# Altium schematic sheet CAN 3V3.SchDoc
size A
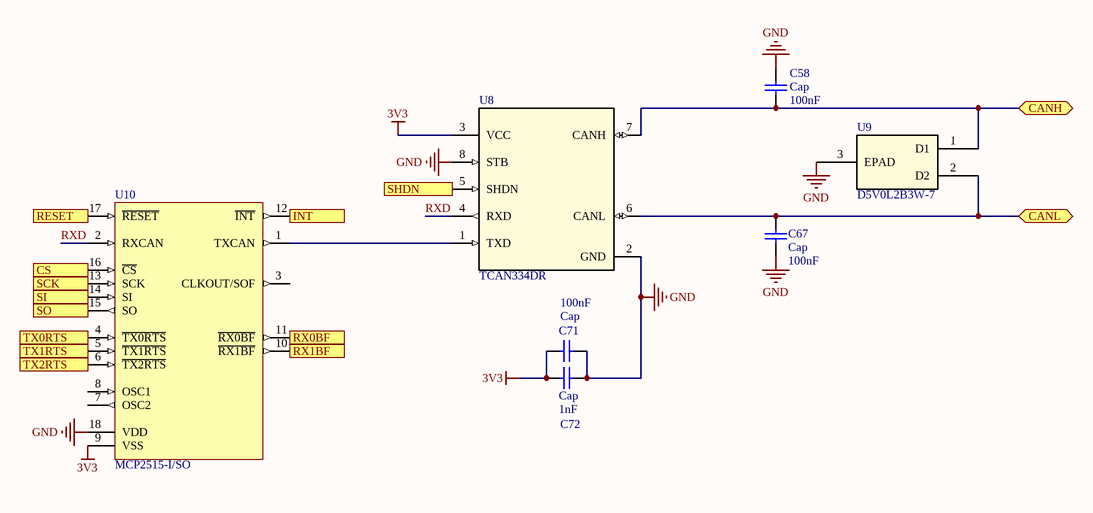
[diagram p0: CAN 3V3.SchDoc]

## Parts
C58  Cap  value 100nF  [1608[0603]]
C67  Cap  value 100nF  [1608[0603]]
C71  Cap  value 100nF  [1608[0603]]
C72  Cap  value 1nF  [1608[0603]]
U8  TCAN334DR  [D0008A_N]
U9  D5V0L2B3W-7  [SOT-323_DIO]
U10  MCP2515-I/SO  [SOIC-SO18_L]

## Ports
CANH (bidir), CANL (bidir), CS (in), INT (out), RESET (in), RX0BF (out), RX1BF (out), SCK (in), SHDN (in), SI (in), SO (out), TX0RTS (in), TX1RTS (in), TX2RTS (in)

## Nets
3V3: C71.1 C72.2 U8.3(VCC) U10.9(VSS)
GND: C58.1 C67.1 C71.2 C72.1 U8.2(GND) U8.8(STB) U9.3(EPAD) U10.18(VDD)
CANH: C58.2 U8.7(CANH) U9.1(D1) ; port CANH
CANL: C67.2 U8.6(CANL) U9.2(D2) ; port CANL
CS: U10.16(~{CS}) ; port CS
INT: U10.12(~{INT}) ; port INT
RESET: U10.17(~{RESET}) ; port RESET
RX0BF: U10.11(~{RX0BF}) ; port RX0BF
RX1BF: U10.10(~{RX1BF}) ; port RX1BF
RXD: U8.4(RXD) U10.2(RXCAN)
SCK: U10.13(SCK) ; port SCK
SHDN: U8.5(SHDN) ; port SHDN
SI: U10.14(SI) ; port SI
SO: U10.15(SO) ; port SO
TX0RTS: U10.4(~{TX0RTS}) ; port TX0RTS
TX1RTS: U10.5(~{TX1RTS}) ; port TX1RTS
TX2RTS: U10.6(~{TX2RTS}) ; port TX2RTS
NetU8_1: U8.1(TXD) U10.1(TXCAN)

Not connected (* = marked no-connect by the designer): U10 3(CLKOUT/SOF) 7(OSC2) 8(OSC1)

## Library data of the parts
C58 C67 C71 C72 = Cap: Capacitor; Published: 8-Jun-2000; LatestRevisionDate: 17-Jul-2002; LatestRevisionNote: Re-released for DXP Platform.; PackageReference: RAD-0.3; Publisher: Altium Limited; PackageDescription: Radial Cap, Thru-Hole; 2 Leads; 0.3 in Pin Spacing
U8 = TCAN334DR: No Description Available; Manufacturer: Texas Instruments; PartNumber: TCAN334DR; RefDes: RefDes; Type: DEV; Value: Value; Copyright: Copyright (C) 2018 Accelerated Designs. All rights reserved
U9 = D5V0L2B3W-7: No Description Available; Vendor: Diodes Inc; Built_By: EMA_UL_Team; SourceLibrary: DIODESINC_2_2015-08-18; Manufacturer_Part_Number: D5V0L2B3W-7; Copyright: Copyright (C) 2018 Accelerated Designs. All rights reserved; RefDes: RefDes; Type: DEV
U10 = CMP-0186-00133-2: Stand-Alone CAN Controller With SPI Interface, 18-Pin SOIC, Industrial Temperature; ComponentLink2Description: Datasheet; RevisionNote: URLs added. DatasheetVersion updated.; PackageVersion: revBB, Aug-2009; ComponentLink1URL: http://www.microchip.com/; PackageReference: SOIC-SO18; PackageDescription: 18-Lead Plastic Small Outline (SO) - Wide 7.50mm Body [SOIC]; DatasheetVersion: revF, Oct-2010; ComponentLink2URL: http://ww1.microchip.com/downloads/en/DeviceDoc/21801f.pdf; ComponentLink3URL: http://www.microchip.com/stellent/groups/techpub_sg/documents/packagingspec/en012702.pdf; Code_JEDEC: MS-013; ComponentLink3Description: Package Specification; ComponentLink1Description: Manufacturer URL